# EasyEDA Pro project wireless charger receiver.eprj, board PCB3
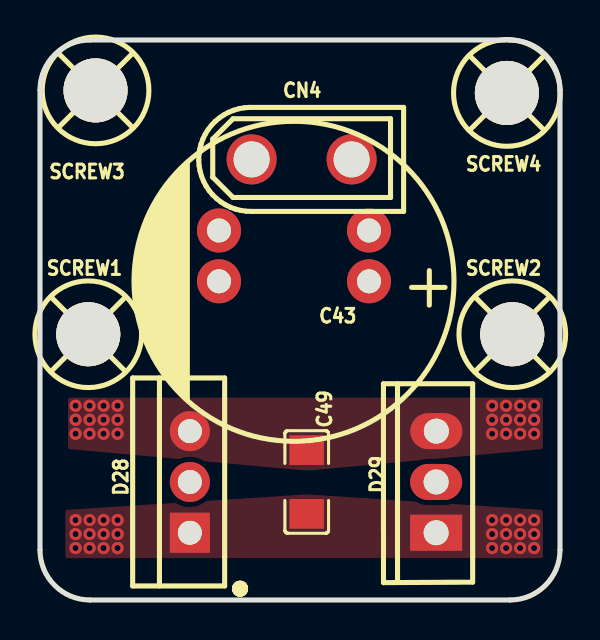
[diagram p5: board, top side]
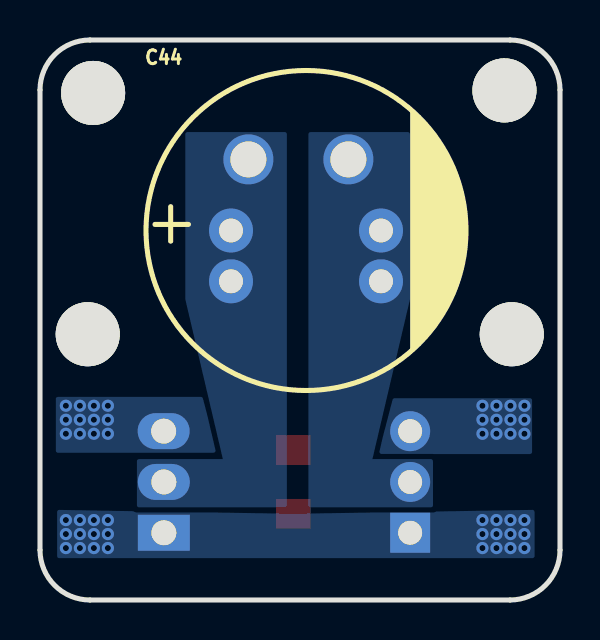
[diagram p6: board, bottom side, seen from below]

Outline 26 x 28 mm; copper layers: Top Layer, Bottom Layer. Coordinates in mm from the lower left corner of the outline.
Outline path: 0,25.5 0,2.5 arc(0.73,0.73) 2.5,0 23.5,0 arc(25.27,0.73) 26,2.5 26,25.5 arc(25.27,27.27) 23.5,28 2.5,28 arc(0.73,27.27) 0,25.5
Stack: Top Layer 0.035mm / Dielectric1 1.51mm FR4 er 4.5 / Bottom Layer 0.035mm

## Design rules (mm)
template: 自定义配置
spacing copperThickness1oz (default): track to track 0.102, other pairs 0.152 to 0.3
spacing copperThickness2oz: track to track 0.203, other pairs 0.152 to 0.3
track width copperThickness1oz (default): min 0.127, default 0.254, max 2.54
track width copperThickness2oz: min 0.203, default 0.254, max 2.54
differential pair differentialPair (default): width min 0.127, default 0.254, max 2.54; gap min 0.152, default 0.152
via viaSize (default): diameter min 0.5, default 0.61, max 10; hole min 0.3, default 0.305, max 6.3
net COIL- uses copperRegion1

## Placement (name value [footprint] x y rotation side)
C43  470uF  [CAP-TH_BD16.0-P7.50-D1.2-FD]  12.7 15.93 180 top
C44  470uF  [CAP-TH_BD16.0-P7.50-D1.2-FD]  12.7 18.47 180 bottom
C49  ？nF  [C1206]  13.34 5.9 270 top
CN4  XT30UPB-M  [CONN-TH_XT30UPB-M]  13.08 22.03 0 top
D28  MURF2060CTR  [TO-220F-3_L10.2-W4.7-P2.54-L]  7.49 5.9 90 top
D29  MURF2060CT  [TO-220-3_L9.9-W4.5-P2.54-L-1]  19.81 5.9 90 top
SCREW1  -  [M3螺丝]  2.41 13.29 0 top
SCREW2  -  [M3螺丝]  23.61 13.29 0 top
SCREW3  -  [M3螺丝]  2.78 25.48 0 top
SCREW4  -  [M3螺丝]  23.34 25.35 0 top

## Footprints (pads in the part's own frame, mm; a bottom-side part is the same pattern mirrored in y, then rotated)
C1206
  rect 1.485x1.728 smd: 1(-1.593,0) 2(1.593,0)
CAP-TH_BD16.0-P7.50-D1.2-FD
  round 2.2 hole 1.2: 1(-3.75,0) 2(3.75,0)
CONN-TH_XT30UPB-M
  round 2.5 hole 1.8: 1(-2.5,0) 2(2.5,0)
M3螺丝
  round 3.2 hole 3.2: 1(0,0)
TO-220-3_L9.9-W4.5-P2.54-L-1
  rect 1.8x2.6 hole 1.25: 1(-2.54,0.005)
  oval 1.8x2.6 hole 1.25: 2(0,0.005) 3(2.54,-0.005)
TO-220F-3_L10.2-W4.7-P2.54-L
  rect 2x2 hole 1.2: 1(-2.54,0)
  round 2 hole 1.2: 2(0,0) 3(2.54,0)

## Nets
As in the schematic.

Pads without a net: SCREW1 1; SCREW2 1; SCREW3 1; SCREW4 1

## Via types
v1: diameter 0.61, hole 0.305, Top Layer to Bottom Layer, 48 vias

## Routing (per net, layer and track width the routed paths; a pad name or vN(x,y) marks a point on that pad's centre or on a via; arc(x,y) is an arc through that point)
COIL+:
  vias: v1(1.78,9.71) v1(1.78,9.01) v1(1.78,8.31) v1(2.48,9.71) v1(2.48,9.01) v1(2.48,8.31) v1(3.18,9.71) v1(3.18,9.01) v1(3.18,8.31) v1(3.88,9.71) v1(3.88,9.01) v1(3.88,8.31) v1(22.61,9.71) v1(22.61,9.01) v1(22.61,8.31) v1(23.31,9.71) v1(23.31,9.01) v1(23.31,8.31) v1(24.01,9.71) v1(24.01,9.01) v1(24.01,8.31) v1(24.71,9.71) v1(24.71,9.01) v1(24.71,8.31)
COIL-:
  vias: v1(1.78,4) v1(1.78,3.3) v1(1.78,2.6) v1(2.48,4) v1(2.48,3.3) v1(2.48,2.6) v1(3.18,4) v1(3.18,3.3) v1(3.18,2.6) v1(3.88,4) v1(3.88,3.3) v1(3.88,2.6) v1(22.61,4) v1(22.61,3.3) v1(22.61,2.6) v1(23.31,4) v1(23.31,3.3) v1(23.31,2.6) v1(24.01,4) v1(24.01,3.3) v1(24.01,2.6) v1(24.71,4) v1(24.71,3.3) v1(24.71,2.6)

## Copper pours and planes (outline as drawn; the poured copper is in the pictures)
COIL+ on Top Layer: 1.4,7.55 13.34,6.47 25.15,7.55 25.15,10.11 1.4,10.11
COIL+ on Bottom Layer: 25.21,7.36 17.15,7.36 17.87,10.16 25.21,10.16
COIL+ on Bottom Layer: 1.4,7.3 9.08,7.3 8.35,10.09 1.4,10.09
COIL- on Top Layer: 1.27,2.09 25.15,2.09 25.15,4.5 13.34,5.28 1.27,4.5
COIL- on Bottom Layer: 1.27,2.09 25.15,2.09 25.15,4.5 13.34,4.31 1.27,4.5
$1N378 on Bottom Layer: 6.35,4.63 12.58,4.63 12.58,23.39 7.5,23.39 7.5,15.03 9.38,7.04 6.35,7.04
$1N380 on Bottom Layer: 21.16,4.63 13.66,4.63 13.66,23.39 18.73,23.39 18.73,15.03 16.85,7.04 21.16,7.04
